# Altium schematic sheet FAN_Conn.SchDoc
size A; SheetNumber: 8; SheetTotal: 16
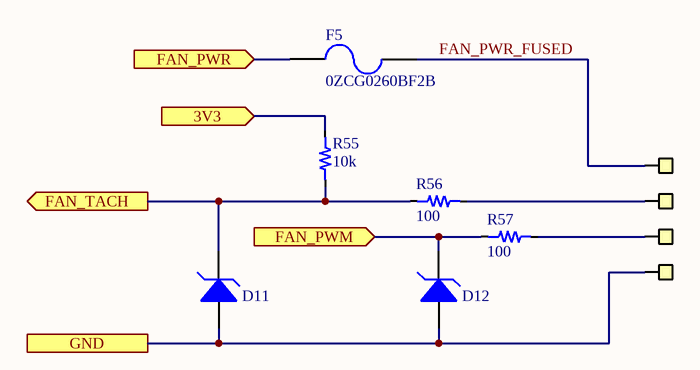
[diagram p0: FAN_Conn.SchDoc]

## Parts
D11  SZMMSZ5227BT1G  [SOD-123]  (value not drawn)
D12  SZMMSZ5227BT1G  [SOD-123]  (value not drawn)
F5  0ZCG0260BF2B  [1812_PTC_FUSE]
R55  value 10k  [0603_RES]  (hidden comment: Resistor)
R56  value 100  [0603_RES]  (hidden comment: Resistor)
R57  value 100  [0603_RES]  (hidden comment: Resistor)
X6  GenericPinHeader(0.1in)  [GenericPinHeader(.1in)]  (value not drawn)
X7  GenericPinHeader(0.1in)  [GenericPinHeader(.1in)]  (value not drawn)
X8  GenericPinHeader(0.1in)  [GenericPinHeader(.1in)]  (value not drawn)
X9  GenericPinHeader(0.1in)  [GenericPinHeader(.1in)]  (value not drawn)

## Ports
3V3 (in), FAN_PWM (in), FAN_PWR (in), FAN_TACH (out), GND

## Nets
3V3: R55.2 ; port 3V3
FAN_PWM: D12.1(K) R57.2 ; port FAN_PWM
FAN_PWR: F5.1 ; port FAN_PWR
FAN_PWR_FUSED: F5.2 X6.1(Pin)
FAN_TACH: D11.1(K) R55.1 R56.2 ; port FAN_TACH
GND: D11.2(A) D12.2(A) X9.1(Pin) ; port GND
NetR56_1: R56.1 X7.1(Pin)
NetR57_1: R57.1 X8.1(Pin)

## Library data of the parts
D11 D12 = SZMMSZ5227BT1G: Zener Diode 3.6 V 500 mW ±5% Surface Mount SOD-123; Vr: 3.6; Num_Circuits: 1; Package: SOD-123; ComponentLink1Description: Digikey; ComponentLink1URL: https://www.digikey.com/en/products/detail/onsemi/SZMMSZ5227BT1G/3063346
F5 = PTC Fuse: Generic PTC fuse footprints. Add; Current - Hold (Ih): 2.6A; Current - Trip (It): 5A; Voltage - Max: *; Resistance - Initial (Ri) (Min): *; Resistance - Post Trip (R1) (Max): *
X6-X9 = GenericPinHeader(0.1in): Generic .1in(2.54mm) pitch pin header
R55-R57 = Resistor: Tolerance: *